# EAGLE design spion (EAGLE 6.5.0)
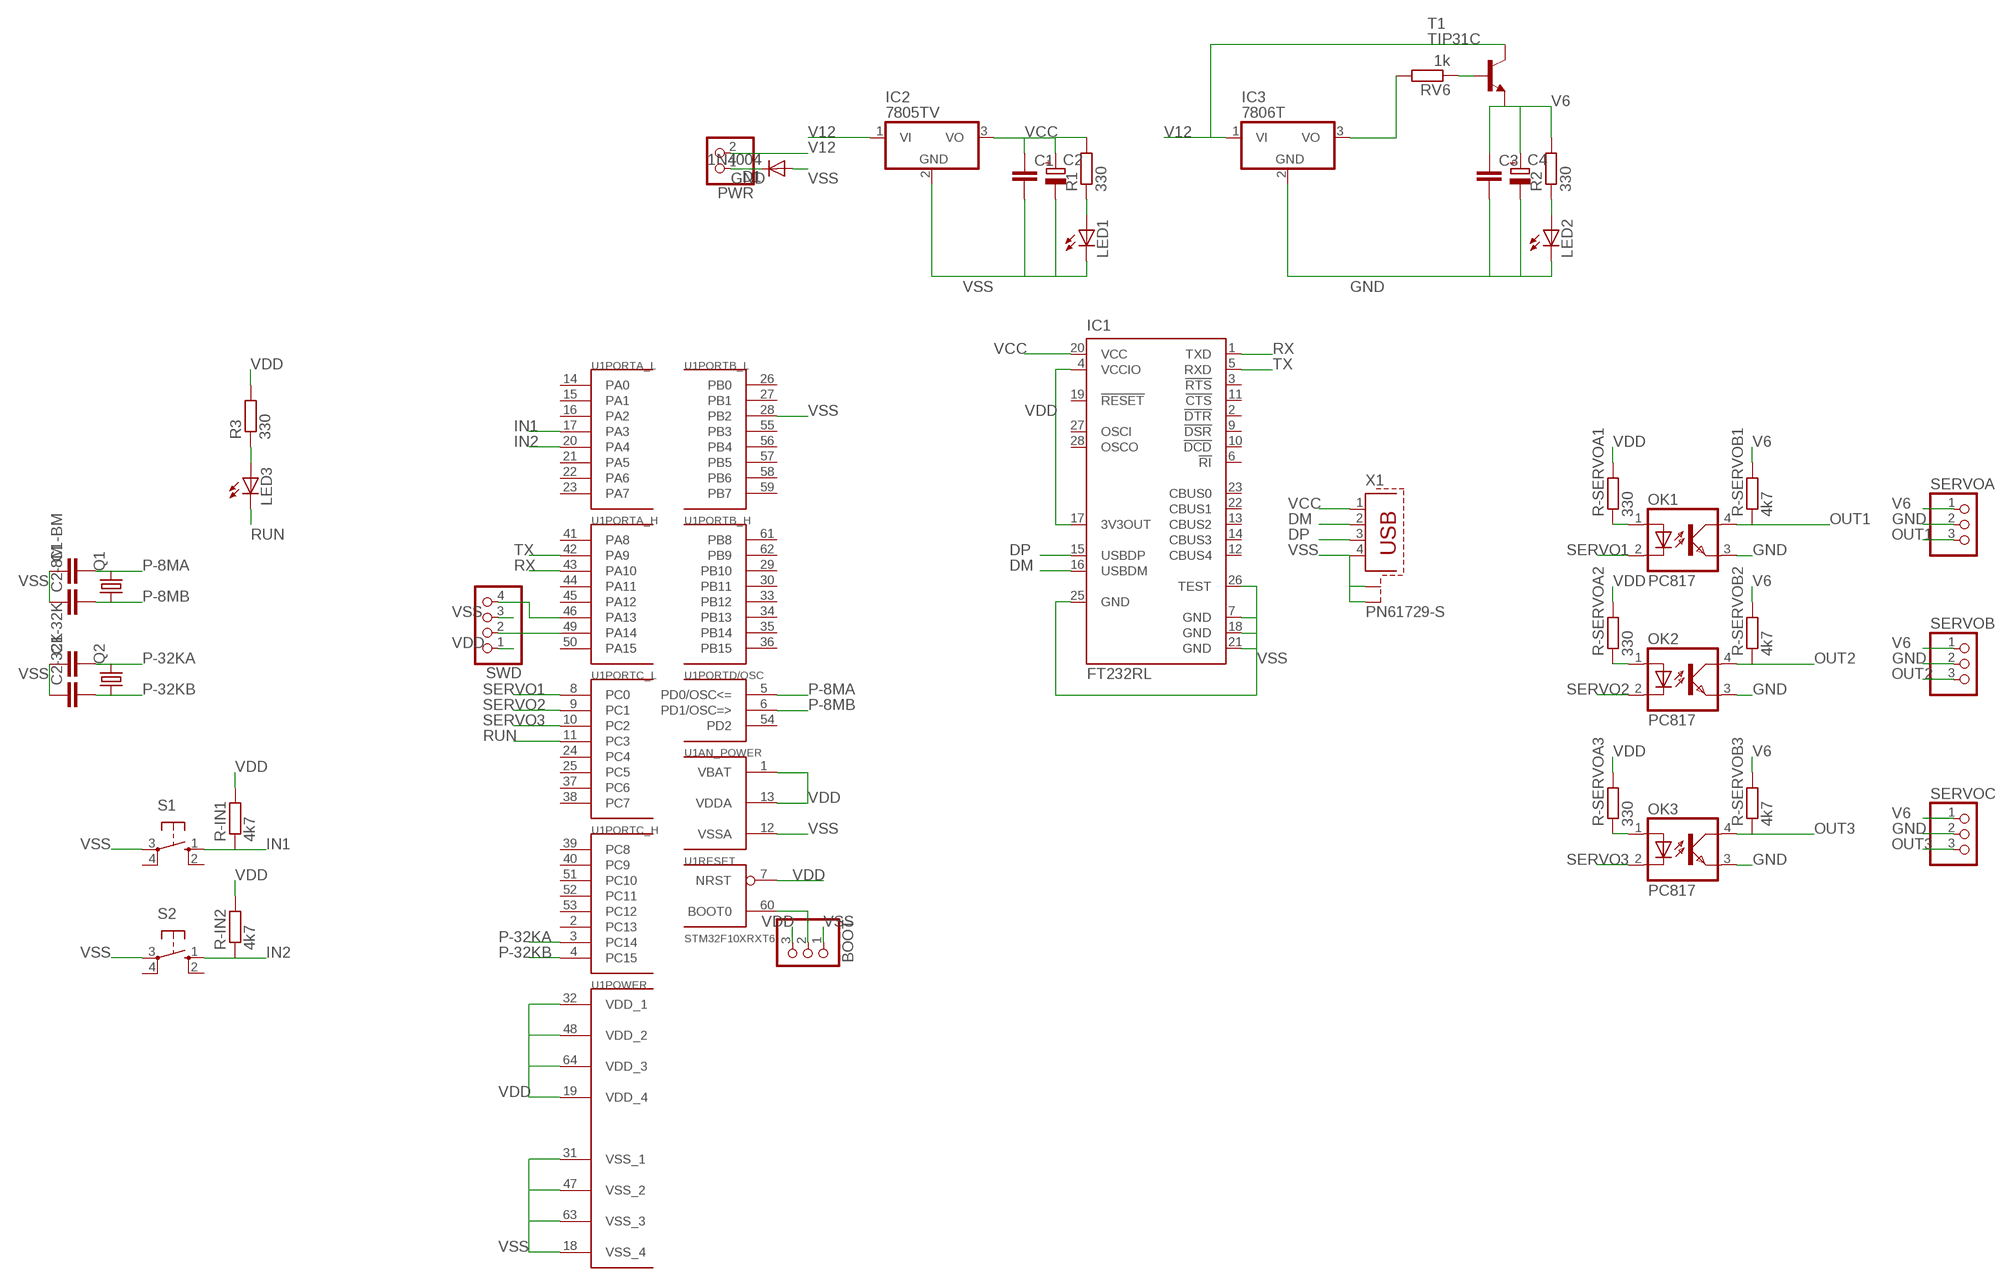
[diagram p0: schematic, sheet 1]

## Parts
BOOT  PINHD-1X3  [1X03]
C1  C-EU025-024X044  [C025-024X044]
C1-32K  C-EU025-024X044  [C025-024X044]
C1-BM  C-EU025-024X044  [C025-024X044]
C2  CPOL-EUE2-5  [E2-5]
C2-8M  C-EU025-024X044  [C025-024X044]
C2-32K  C-EU025-024X044  [C025-024X044]
C3  C-EU025-024X044  [C025-024X044]
C4  CPOL-EUE2-5  [E2-5]
D1  1N4004  [DO41-10]
IC1  FT232RL  [SSOP28]
IC2  7805TV  [TO220V]
IC3  7806T  [TO220H]
LED1  LED3MM  [LED3MM]
LED2  LED3MM  [LED3MM]
LED3  LED3MM  [LED3MM]
OK1  PC817  [DIL04]
OK2  PC817  [DIL04]
OK3  PC817  [DIL04]
PWR  PINHD-1X2  [1X02]
Q1  CRYSTALHC49S  [HC49/S]
Q2  CRYSTALTC26V  [TC26V]
R1  330  R-EU_0204/7  [0204/7]
R2  330  R-EU_0204/7  [0204/7]
R3  330  R-EU_0204/7  [0204/7]
R-IN1  4k7  R-EU_0204/7  [0204/7]
R-IN2  4k7  R-EU_0204/7  [0204/7]
R-SERVOA1  330  R-EU_0204/7  [0204/7]
R-SERVOA2  330  R-EU_0204/7  [0204/7]
R-SERVOA3  330  R-EU_0204/7  [0204/7]
R-SERVOB1  4k7  R-EU_0204/7  [0204/7]
R-SERVOB2  4k7  R-EU_0204/7  [0204/7]
R-SERVOB3  4k7  R-EU_0204/7  [0204/7]
RV6  1k  R-EU_0204/7  [0204/7]
S1  10-XX  [B3F-10XX]
S2  10-XX  [B3F-10XX]
SERVOA  PINHD-1X3  [1X03]
SERVOB  PINHD-1X3  [1X03]
SERVOC  PINHD-1X3  [1X03]
SWD  PINHD-1X4  [1X04]
T1  TIP31C  [TO220]
U1  STM32F10XRXT6  [TQFP64]
X1  PN61729-S  [PN61729-S]

## Nets
DM: IC1.16(USBDM) X1.2
DP: IC1.15(USBDP) X1.3
GND: C3.2 C4.- D1.C IC3.2(GND) LED2.K(C) OK1.3(EMIT) OK2.3(EMIT) OK3.3(EMIT) PWR.1 SERVOA.2 SERVOB.2 SERVOC.2
IN1: R-IN1.1 S1.1(S) U1.17(PORTA_L:PA3)
IN2: R-IN2.1 S2.1(S) U1.20(PORTA_L:PA4)
N$1: SWD.2 U1.49(PORTA_H:PA14)
N$2: SWD.4 U1.46(PORTA_H:PA13)
N$3: BOOT.2 U1.60(RESET:BOOT0)
N$4: OK1.1(A) R-SERVOA1.1
N$5: LED3.A R3.1
N$6: IC3.3(VO) RV6.2
N$7: OK2.1(A) R-SERVOA2.1
N$8: RV6.1 T1.1(B)
N$9: OK3.1(A) R-SERVOA3.1
N$14: LED1.A R1.1
N$18: LED2.A R2.1
OUT1: OK1.4(COL) R-SERVOB1.1 SERVOA.3
OUT2: OK2.4(COL) R-SERVOB2.1 SERVOB.3
OUT3: OK3.4(COL) R-SERVOB3.1 SERVOC.3
P-8MA: C1-BM.2 Q1.2 U1.5(PORTD/OSC:PD0/OSC<=)
P-8MB: C2-8M.2 Q1.1 U1.6(PORTD/OSC:PD1/OSC=>)
P-32KA: C1-32K.2 Q2.2 U1.3(PORTC_H:PC14)
P-32KB: C2-32K.2 Q2.1 U1.4(PORTC_H:PC15)
RUN: LED3.K(C) U1.11(PORTC_L:PC3)
RX: IC1.1(TXD) U1.43(PORTA_H:PA10)
SERVO1: OK1.2(C) U1.8(PORTC_L:PC0)
SERVO2: OK2.2(C) U1.9(PORTC_L:PC1)
SERVO3: OK3.2(C) U1.10(PORTC_L:PC2)
TX: IC1.5(RXD) U1.42(PORTA_H:PA9)
V6: C3.1 C4.+ R2.2 R-SERVOB1.2 R-SERVOB2.2 R-SERVOB3.2 SERVOA.1 SERVOB.1 SERVOC.1 T1.3(E)
V12: IC2.1(VI) IC3.1(VI) PWR.2 T1.2(C)
VCC: C1.1 C2.+ IC1.20(VCC) IC2.3(VO) R1.2 X1.1
VDD: BOOT.3 IC1.4(VCCIO) IC1.17(3V3OUT) R3.2 R-IN1.2 R-IN2.2 R-SERVOA1.2 R-SERVOA2.2 R-SERVOA3.2 SWD.1 U1.1(AN_POWER:VBAT) U1.7(RESET:NRST) U1.13(AN_POWER:VDDA) U1.19(POWER:VDD_4) U1.32(POWER:VDD_1) U1.48(POWER:VDD_2) U1.64(POWER:VDD_3)
VSS: BOOT.1 C1-32K.1 C1-BM.1 C1.2 C2-8M.1 C2-32K.1 C2.- D1.A IC1.7(GND) IC1.18(GND) IC1.21(GND) IC1.25(GND) IC1.26(TEST) IC2.2(GND) LED1.K(C) S1.3(P) S2.3(P) SWD.3 U1.12(AN_POWER:VSSA) U1.18(POWER:VSS_4) U1.28(PORTB_L:PB2) U1.31(POWER:VSS_1) U1.47(POWER:VSS_2) U1.63(POWER:VSS_3) X1.4 X1.S1 X1.S2
Unconnected: IC1.2(!DTR) IC1.3(!RTS) IC1.6(!RI) IC1.9(!DSR) IC1.10(!DCD) IC1.11(!CTS) IC1.12(CBUS4) IC1.13(CBUS2) IC1.14(CBUS3) IC1.19(!RESET) IC1.22(CBUS1) IC1.23(CBUS0) IC1.27(OSCI) IC1.28(OSCO) S1.2(S1) S1.4(P1) S2.2(S1) S2.4(P1) U1.2(PORTC_H:PC13) U1.14(PORTA_L:PA0) U1.15(PORTA_L:PA1) U1.16(PORTA_L:PA2) U1.21(PORTA_L:PA5) U1.22(PORTA_L:PA6) U1.23(PORTA_L:PA7) U1.24(PORTC_L:PC4) U1.25(PORTC_L:PC5) U1.26(PORTB_L:PB0) U1.27(PORTB_L:PB1) U1.29(PORTB_H:PB10) U1.30(PORTB_H:PB11) U1.33(PORTB_H:PB12) U1.34(PORTB_H:PB13) U1.35(PORTB_H:PB14) U1.36(PORTB_H:PB15) U1.37(PORTC_L:PC6) U1.38(PORTC_L:PC7) U1.39(PORTC_H:PC8) U1.40(PORTC_H:PC9) U1.41(PORTA_H:PA8) U1.44(PORTA_H:PA11) U1.45(PORTA_H:PA12) U1.50(PORTA_H:PA15) U1.51(PORTC_H:PC10) U1.52(PORTC_H:PC11) U1.53(PORTC_H:PC12) U1.54(PORTD/OSC:PD2) U1.55(PORTB_L:PB3) U1.56(PORTB_L:PB4) U1.57(PORTB_L:PB5) U1.58(PORTB_L:PB6) U1.59(PORTB_L:PB7) U1.61(PORTB_H:PB8) U1.62(PORTB_H:PB9)

## Library data of the parts
BOOT SERVOA SERVOB SERVOC = pinhead:PINHD-1X3: PIN HEADER
C1 C1-32K C1-BM C2-8M C2-32K C3 = resistor:C-EU: CAPACITOR, European symbol
C2 C4 = resistor:CPOL-EU: POLARIZED CAPACITOR, European symbol
D1 = diode:1N4004: DIODE general purpose rectifier, 1 A
IC1 = ftdichip:FT232R: Source: http://www.ftdichip.com/Documents/DataSheets/DS_FT232R_v104.pdf; MPN: FT232RL; OC_FARNELL: 1146032; OC_NEWARK: 91K9918
IC2 IC3 = linear:78*: Positive VOLTAGE REGULATOR Source: http://cache.national.com/ds/LM/LM78L05.pdf http://www.fairchildsemi.com/ds/LM/LM7805.pdf
LED1-LED3 = led:LED: LED OSRAM: - CHIPLED LG R971, LG N971, LY N971, LG Q971, LY Q971, LO R971, LY R971 LH N974, LH R974 LS Q976, LO Q976, LY Q976 LO Q996 - Hyper CHIPLED LW Q18S LB Q993, LB Q99A, LB R99A - SideLED LS A670, LO A670, LY A670, LG A670, LP A670 LB A673, LV A673, LT A673, LW A673 LH A674 LY A675 LS A676, LA A676, LO A676, LY A676, LW A676 LS A679, LY A679, LG A679 - Hyper Micro SIDELED® LS Y876, LA Y876, LO Y876, LY Y876 LT Y87S - SmartLED LW L88C, LW L88S LB L89C, LB L89S, LG L890 LS L89K, LO L89K, LY L89K LS L896, LA L896, LO L896, LY L896 - TOPLED LS T670, LO T670, LY T670, LG T670, LP T670 LSG T670, LSP T670, LSY T670, LOP T670, LYG T670 LG T671, LOG T671, LSG T671 LB T673, LV T673, LT T673, LW T673 LH T674 LS T676, LA T676, LO T676, LY T676, LB T676, LH T676, LSB T676, LW T676 LB T67C, LV T67C, LT T67C, LS T67K, LO T67K, LY T67K, LW E67C LS E67B, LA E67B, LO E67B, LY E67B, LB E67C, LV E67C, LT E67C LW T67C LS T679, LY T679, LG T679 LS T770, LO T770, LY T770, LG T770, LP T770 LB T773, LV T773, LT T773, LW T773 LH T774 LS E675, LA E675, LY E675, LS T675 LS T776, LA T776, LO T776, LY T776, LB T776 LHGB T686 LT T68C, LB T68C - Hyper Mini TOPLED® LB M676 - Mini TOPLED Santana® LG M470 LS M47K, LO M47K, LY M47K Source: http://www.osram.convergy.de LUXEON: - LUMILED® LXK2-PW12-R00, LXK2-PW12-S00, LXK2-PW14-U00, LXK2-PW14-V00 LXK2-PM12-R00, LXK2-PM12-S00, LXK2-PM14-U00 LXK2-PE12-Q00, LXK2-PE12-R00, LXK2-PE12-S00, LXK2-PE14-T00, LXK2-PE14-U00 LXK2-PB12-K00, LXK2-PB12-L00, LXK2-PB12-M00, LXK2-PB14-N00, LXK2-PB14-P00, LXK2-PB14-Q00 LXK2-PR12-L00, LXK2-PR12-M00, LXK2-PR14-Q00, LXK2-PR14-R00 LXK2-PD12-Q00, LXK2-PD12-R00, LXK2-PD12-S00 LXK2-PH12-R00, LXK2-PH12-S00 LXK2-PL12-P00, LXK2-PL12-Q00, LXK2-PL12-R00 Source: www.luxeon.com KINGBRIGHT: KA-3528ASYC Source: www.kingbright.com
OK1-OK3 = optocoupler:PC817: SHARP OPTO COUPLER; MPN: PC817X4J000F; OC_FARNELL: 9707727; OC_NEWARK: 97K7059
PWR = pinhead:PINHD-1X2: PIN HEADER
Q1 = crystal:CRYSTAL: CRYSTAL; OC_FARNELL: 1667008; OC_NEWARK: unknown
Q2 = crystal:CRYSTAL: CRYSTAL; OC_FARNELL: unknown; OC_NEWARK: unknown
R1-R3 R-IN1 R-IN2 R-SERVOA1-R-SERVOA3 R-SERVOB1-R-SERVOB3 RV6 = resistor:R-EU_: RESISTOR, European symbol
S1 S2 = switch-omron:10-XX: OMRON SWITCH; MPN: B3F-1000; OC_FARNELL: 176432; OC_NEWARK: 36M3542
SWD = pinhead:PINHD-1X4: PIN HEADER
T1 = transistor-neu-to92:TIP31C: NPN TRANSISTOR
U1 = stm32:STM32F10XRXT6: STM32F101/103 64pin LQFP
X1 = con-berg:PN61729-S: BERG USB connector; OC_FARNELL: unknown; OC_NEWARK: unknown

## Board
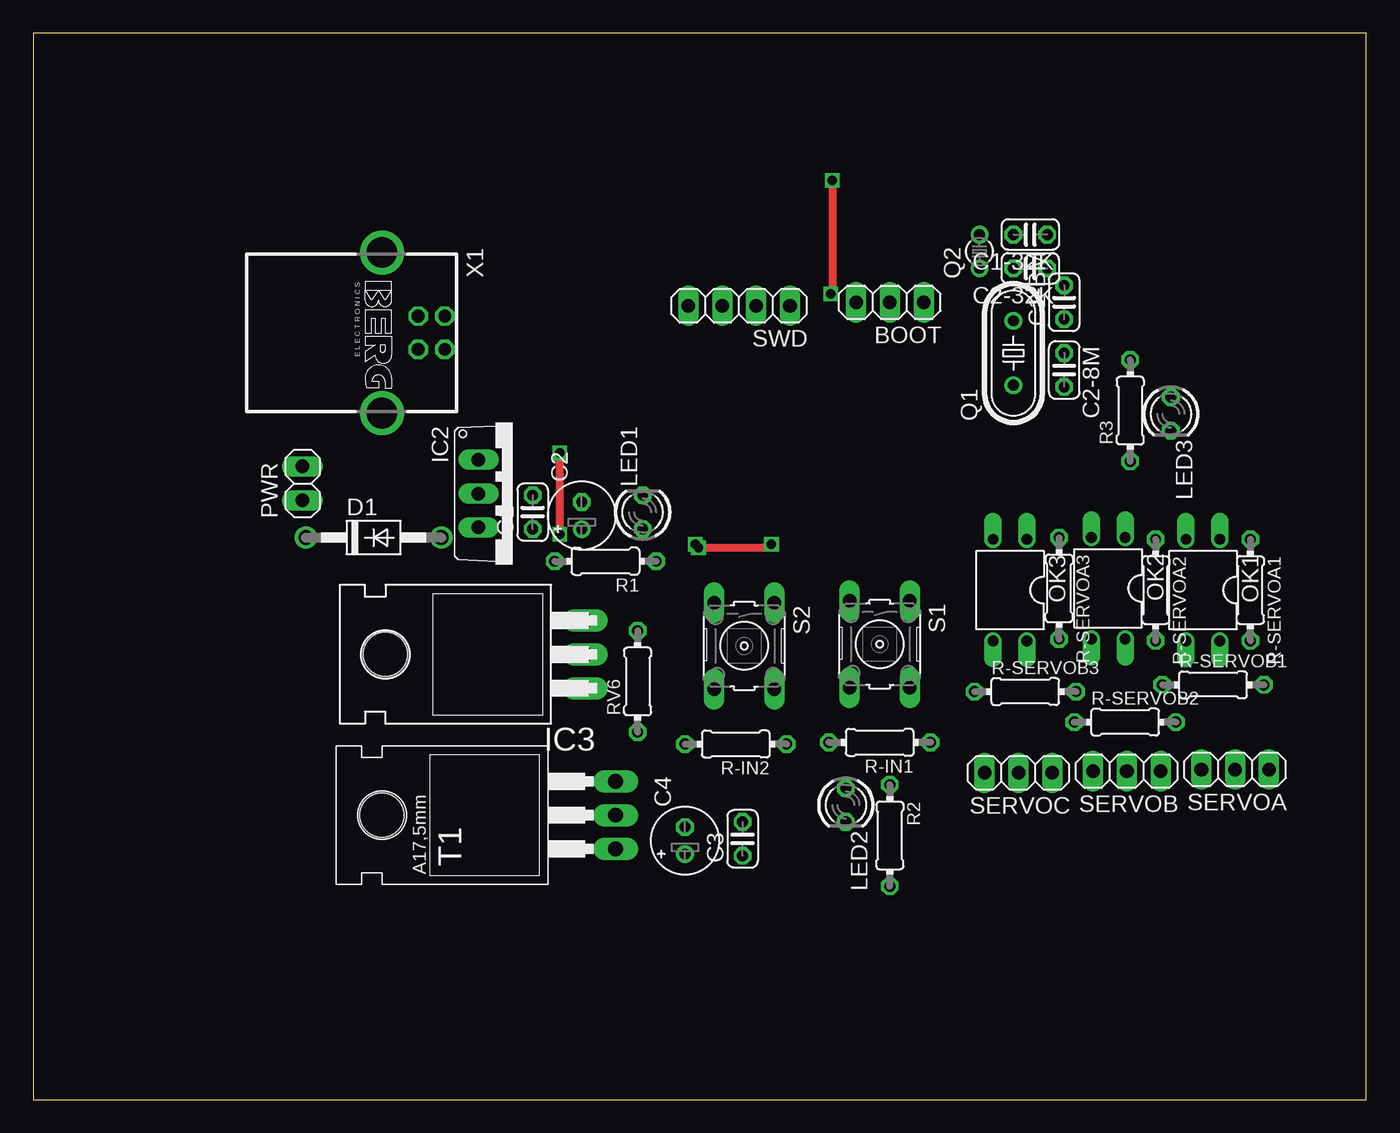
[diagram p1: board, top side]
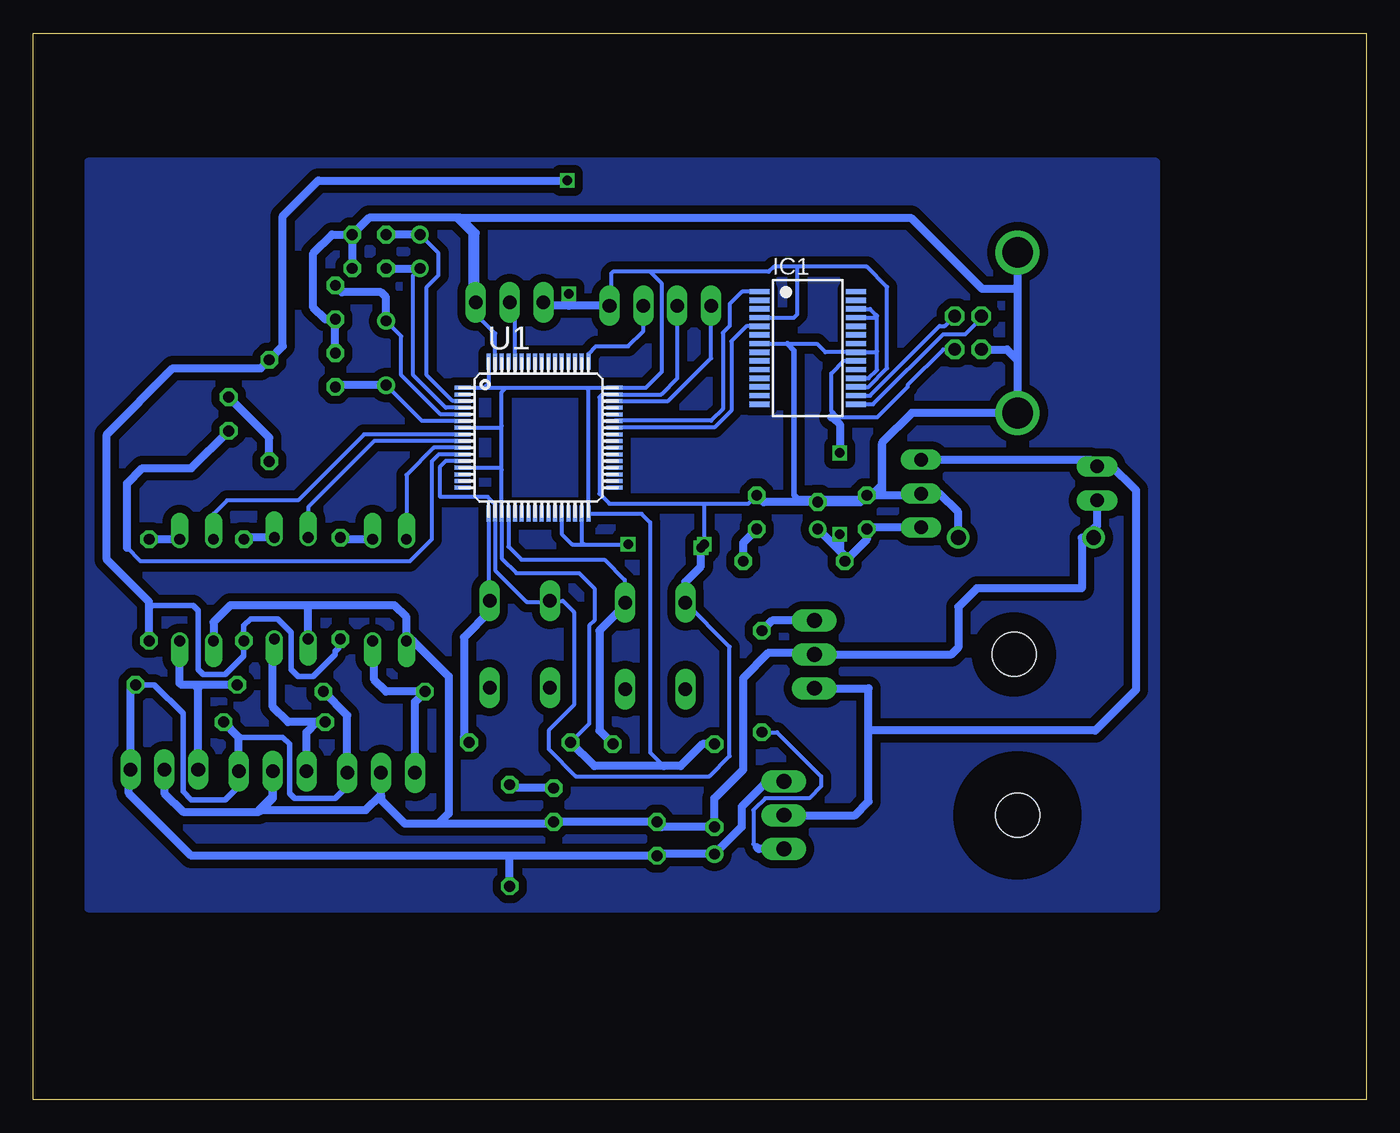
[diagram p2: board, bottom side, seen from below]

Size 100 x 80 mm. Coordinates in mm from the lower left corner, seen from the top.
Outline: 0,0 100,0 100,80 0,80 0,0
Copper layers (1*16): Top 0.035mm / dielectric 1.5mm / Bottom 0.035mm
Design rules "default": minimum track width 10mil, minimum drill 24mil, track to track 8mil, track to pad 8mil, pad to pad 8mil, via to via 8mil, smd to smd 8mil, copper to edge 40mil, drill to drill 8mil, minimum pad ring 10mil, minimum via ring 8mil, stop-mask expansion 4mil, vias tented up to drill 0mil, thermal gap 10mil

### Footprints (pad centres in the part's own frame; a part is rotated, then mirrored left to right if it is on the bottom)
1X03 = drill 1.016 long: 1 -2.54,0; 2 0,0; 3 2.54,0
C025-024X044 = drill 0.813 octagon: 1 -1.27,0; 2 1.27,0
E2-5 = drill 0.813 pad 1.27: + -1.016,0 | drill 0.813 pad 1.27 octagon: - 1.016,0
DO41-10 = drill 1.118: A 5.08,0; C -5.08,0
SSOP28 = smd 0.4 x 1.5: 1 -4.225,-3.625; 2 -3.575,-3.625; 3 -2.925,-3.625; 4 -2.275,-3.625; 5 -1.625,-3.625; 6 -0.975,-3.625; 7 -0.325,-3.625; 8 0.325,-3.625; 9 0.975,-3.625; 10 1.625,-3.625; 11 2.275,-3.625; 12 2.925,-3.625; 13 3.575,-3.625; 14 4.225,-3.625; 15 4.225,3.625; 16 3.575,3.625; 17 2.925,3.625; 18 2.275,3.625; 19 1.625,3.625; 20 0.975,3.625; 21 0.325,3.625; 22 -0.325,3.625; 23 -0.975,3.625; 24 -1.625,3.625; 25 -2.275,3.625; 26 -2.925,3.625; 27 -3.575,3.625; 28 -4.225,3.625
TO220V = drill 1.016 long: 1 -2.54,-2.54; 2 0,-2.54; 3 2.54,-2.54
TO220H = drill 1.118 long: 1 -2.54,-10.16; 2 0,-10.16; 3 2.54,-10.16 | hole 3.302: 0,4.826
LED3MM = drill 0.813 octagon: A -1.27,0; K 1.27,0
DIL04 = drill 0.813 offset: 1 -1.27,-3.81; 2 1.27,-3.81; 3 1.27,3.81; 4 -1.27,3.81
1X02 = drill 1.016 long: 1 -1.27,0; 2 1.27,0
HC49/S = drill 0.813: 1 -2.413,0; 2 2.413,0
TC26V = drill 0.813: 1 -1.27,0; 2 1.27,0
0204/7 = drill 0.813 octagon: 1 -3.81,0; 2 3.81,0
B3F-10XX = drill 1.016 long: 1 -3.251,2.261; 2 3.251,2.261; 3 -3.251,-2.261; 4 3.251,-2.261
1X04 = drill 1.016 long: 1 -3.81,0; 2 -1.27,0; 3 1.27,0; 4 3.81,0
TO220 = drill 1.118 long: 1 -2.54,-6.35; 2 0,-6.35; 3 2.54,-6.35 | hole 3.302: 0,11.176
TQFP64 = smd 1.2 x 0.3: 1 -5.7,3.75; 2 -5.7,3.25; 3 -5.7,2.75; 4 -5.7,2.25; 5 -5.7,1.75; 6 -5.7,1.25; 7 -5.7,0.75; 8 -5.7,0.25; 9 -5.7,-0.25; 10 -5.7,-0.75; 11 -5.7,-1.25; 12 -5.7,-1.75; 13 -5.7,-2.25; 14 -5.7,-2.75; 15 -5.7,-3.25; 16 -5.7,-3.75; 33 5.7,-3.75; 34 5.7,-3.25; 35 5.7,-2.75; 36 5.7,-2.25; 37 5.7,-1.75; 38 5.7,-1.25; 39 5.7,-0.75; 40 5.7,-0.25; 41 5.7,0.25; 42 5.7,0.75; 43 5.7,1.25; 44 5.7,1.75; 45 5.7,2.25; 46 5.7,2.75; 47 5.7,3.25; 48 5.7,3.75 | smd 0.3 x 1.2: 17 -3.75,-5.7; 18 -3.25,-5.7; 19 -2.75,-5.7; 20 -2.25,-5.7; 21 -1.75,-5.7; 22 -1.25,-5.7; 23 -0.75,-5.7; 24 -0.25,-5.7; 25 0.25,-5.7; 26 0.75,-5.7; 27 1.25,-5.7; 28 1.75,-5.7; 29 2.25,-5.7; 30 2.75,-5.7; 31 3.25,-5.7; 32 3.75,-5.7; 49 3.75,5.7; 50 3.25,5.7; 51 2.75,5.7; 52 2.25,5.7; 53 1.75,5.7; 54 1.25,5.7; 55 0.75,5.7; 56 0.25,5.7; 57 -0.25,5.7; 58 -0.75,5.7; 59 -1.25,5.7; 60 -1.75,5.7; 61 -2.25,5.7; 62 -2.75,5.7; 63 -3.25,5.7; 64 -3.75,5.7
PN61729-S = drill 0.95 octagon: 1 1.25,4.71; 2 -1.25,4.71; 3 -1.25,2.71; 4 1.25,2.71 | drill 2.3 pad 2.9: S1 -6.02,0; S2 6.02,0

### Placement (x,y rotation side)
BOOT  64.26,59.82 180 top
C1  37.47,44.07 90 top
C1-32K  74.8,64.9 180 top
C1-BM  77.34,59.82 90 top
C2  41.15,43.81 90 top
C2-8M  77.34,54.74 270 top
C2-32K  74.8,62.36 180 top
C3  53.21,19.56 90 top
C4  48.9,19.43 90 top
D1  25.53,42.16 0 top
IC1  41.91,56.39 270 bottom
IC2  35.94,45.47 270 top
IC3  31.24,33.4 90 top
LED1  45.72,44.07 90 top
LED2  60.96,22.1 270 top
LED3  85.34,51.44 270 top
OK1  87.76,38.23 180 top
OK2  80.64,38.35 180 top
OK3  73.28,38.23 180 top
PWR  20.19,46.23 90 top
Q1  73.53,56.01 90 top
Q2  70.99,63.63 90 top
R1  42.93,40.39 180 top
R2  64.26,19.81 270 top
R3  82.3,51.69 90 top
R-IN1  63.5,26.8 180 top
R-IN2  52.7,26.67 180 top
R-SERVOA1  91.31,38.23 270 top
R-SERVOA2  84.2,38.23 270 top
R-SERVOA3  76.96,38.35 270 top
R-SERVOB1  88.52,31.11 0 top
R-SERVOB2  81.92,28.32 0 top
R-SERVOB3  74.42,30.61 0 top
RV6  45.34,31.37 90 top
S1  63.5,34.16 270 top
S2  53.34,34.04 270 top
SERVOA  90.17,24.77 180 top
SERVOB  82.04,24.64 180 top
SERVOC  73.91,24.51 180 top
SWD  52.96,59.56 180 top
T1  37.34,21.34 90 top
U1  62.1,49.66 0 bottom
X1  26.16,57.53 270 top

### Tracks (layer width: path | path; a pad name or v marks a point on that pad's centre or on a via)
DM
  Bottom 0.305: IC1.16 37.23,52.81 32,58.04 31.61,58.04 X1.2
DP
  Bottom 0.305: X1.3 28.87,58.63 30.1,57.4 31.75,57.4 36.99,52.16 IC1.15
GND
  Bottom 0.61: 79.38,37.08 72.9,37.08 72.01,36.2 OK3.3 71.5,34.42 68.83,31.75 68.83,21.46 69.6,20.7 | 79.38,37.08 85.22,37.08 86.49,35.81 OK1.3 | OK2.3 79.38,37.08 | SERVOA.2 90.17,22.99 88.77,21.59 83.06,21.59 82.04,22.61 SERVOB.2 82.04,22.73 83.06,21.72 75.06,21.72 73.91,22.86 | 73.91,22.86 SERVOC.2 | 41.91,33.53 44.83,33.53 46.74,31.62 46.74,24.77 48.9,22.61 C4.- 52.83,20.45 C3.2 LED2.K 61.09,20.7 69.6,20.7 | 41.91,33.53 41.53,33.53 IC3.2 | D1.C 21.08,42.16 | 21.08,42.16 21.34,42.16 21.34,38.35 29.21,38.35 30.61,36.96 30.61,33.91 31.11,33.4 41.78,33.4 41.91,33.53 | PWR.1 20.19,43.05 21.08,42.16 | 73.91,22.86 73.91,22.48 72.14,20.7 69.6,20.7
IN1
  Bottom 0.305: U1.17 65.85,37.51 S1.1
  Bottom 0.61: S1.1 65.76,36.6 67.69,34.67 67.69,27.18 R-IN1.1
IN2
  Bottom 0.305: U1.20 64.35,41.49 63.37,40.51 57.15,40.51 55.63,38.99 55.63,37.31 S2.1
  Bottom 0.61: S2.1 55.6,37.11 57.53,35.18 57.53,27.69 R-IN2.1
N$1
  Bottom 0.305: U1.49 58.35,55.95 57.78,56.52 55.37,56.52 54.23,57.66 SWD.2
N$2
  Bottom 0.305: U1.46 52.37,52.41 49.15,55.63 SWD.4
N$3
  Bottom 0.305: U1.60 63.85,59.41 BOOT.2
N$4
  Bottom 0.61: OK1.1 R-SERVOA1.1
N$5
  Bottom 0.61: R3.1 82.3,49.66 LED3.A
N$6
  Bottom 0.61: IC3.3 44.58,35.94 RV6.2
N$7
  Bottom 0.61: OK2.1 84.07,42.16 R-SERVOA2.1
N$8
  Bottom 0.305: RV6.1 44.2,27.56 40.89,24.26 40.89,23.5 41.78,22.61 45.09,22.61 45.97,21.72 45.97,19.18 45.72,18.92
  Bottom 0.61: T1.1 45.59,18.8 45.72,18.92
N$9
  Bottom 0.61: OK3.1 76.83,42.04 R-SERVOA3.1
N$10
  pour Bottom (isolate 0.61): 15.75,70.36 95.89,70.36 95.89,14.35 15.75,14.35
N$14
  Bottom 0.61: R1.1 46.74,41.78 LED1.A
N$18
  Bottom 0.61: LED2.A 64.01,23.37 R2.1
OUT1
  Bottom 0.61: R-SERVOB1.1 87.88,31.11 | 87.88,31.11 88.9,31.11 89.03,31.24 OK1.4 | SERVOA.3 87.63,30.86 87.88,31.11
OUT2
  Bottom 0.61: R-SERVOB2.1 78.74,28.32 | 78.74,28.32 80.9,28.32 82.04,29.46 82.04,34.42 OK2.4 | SERVOB.3 79.5,27.56 78.74,28.32
OUT3
  Bottom 0.61: OK3.4 74.42,34.29 74.42,31.5 73.53,30.61 R-SERVOB3.1 71.37,29.84 SERVOC.3
P-8MA
  Bottom 0.305: U1.5 69.44,51.41 72.39,54.36 72.39,57.28 Q1.2
  Bottom 0.61: Q1.2 73.53,60.2 73.91,60.58 76.83,60.58 C1-BM.2
P-8MB
  Bottom 0.305: U1.6 70.85,50.91 Q1.1
  Bottom 0.61: Q1.1 77.22,53.59 C2-8M.2
P-32KA
  Bottom 0.305: U1.3 68.54,52.41 70.48,54.36 70.48,60.96 69.6,61.85 69.6,63.5 Q2.2
  Bottom 0.61: Q2.2 C1-32K.2
P-32KB
  Bottom 0.305: U1.4 69.05,51.91 71.5,54.36 71.5,61.85 Q2.1
  Bottom 0.61: C2-32K.2 Q2.1
RUN
  Bottom 0.305: U1.11 69.58,48.41 70.1,47.88 70.1,42.04 71.75,40.39 91.95,40.39 92.96,41.4
  Bottom 0.61: 92.96,41.4 92.96,46.23 91.82,47.37 88.14,47.37 LED3.K
RX
  Bottom 0.305: IC1.1 46.83,60.61 47.75,59.69 47.75,58.04 48.26,57.53 48.26,51.82 49.15,50.93 56.38,50.93 U1.43
SERVO1
  Bottom 0.305: U1.8 75.19,49.91 80.14,44.96 85.47,44.96 86.49,43.94 OK1.2
SERVO2
  Bottom 0.305: U1.9 74.42,49.41 79.38,44.45 OK2.2
SERVO3
  Bottom 0.305: U1.10 69.97,48.91 72.01,46.86 OK3.2
TX
  Bottom 0.305: IC1.5 46.51,58.01 47.62,56.9 47.62,51.69 48.9,50.42 U1.42
V6
  Bottom 0.406: 84.58,27.18 81.28,27.18 80.77,26.67 80.77,22.99 80.39,22.61 77.34,22.61 76.45,23.5 SERVOC.1 | R-SERVOB1.2 90.93,31.11 88.77,28.96 88.77,23.11 88.14,22.48 85.6,22.48 84.71,23.37 84.71,24.51 SERVOB.1
  Bottom 0.61: SERVOB.1 84.58,27.18 R-SERVOB2.2 | R-SERVOB1.2 92.71,30.73 SERVOA.1 92.84,24.64 92.84,22.99 88.14,18.29 64.14,18.29 | SERVOC.1 76.45,28.83 R-SERVOB3.2 | T1.3 44.96,23.88 46.86,21.97 46.86,20.45 C4.+ 53.09,18.41 C3.1 64.14,18.29 | R2.2 64.26,18.16 64.14,18.29
V12
  Bottom 0.61: IC2.1 20.7,48.01 PWR.2 20.07,47.62 19.18,47.62 17.27,45.72 17.27,30.73 20.32,27.69 37.21,27.69 37.34,27.56 | IC3.1 37.34,30.86 37.34,27.56 | T1.2 38.35,21.34 37.34,22.35 37.34,27.56
VCC  (via drill 0.7)
  Top 0.61: v39.5,48.51 v39.5,42.42
  Bottom 0.305: X1.1 31.73,56.28 34.42,53.59 34.42,53.47 36.7,51.18 39.62,51.18 40.13,51.69 | 40.13,51.69 40.13,54.48 39.2,55.41 IC1.20 | 40.13,51.69 40.13,51.18
  Bottom 0.61: IC2.3 37.34,42.93 C1.1 37.47,42.04 R1.2 39.12,40.77 39.5,41.15 | 39.5,41.15 C2.+ | 40.13,51.18 40.01,51.18 39.5,50.67 v39.5,48.51 | v39.5,42.42 39.5,41.15
VDD  (via drill 0.7)
  Top 0.61: v59.94,68.96 59.94,60.58 v59.82,60.45
  Bottom 0: 76.96,34.04 76.96,33.78 78.11,32.64 | 81.66,36.07 83.82,36.07 84.2,35.69 84.2,33.27 | 88.01,37.08 91.19,37.08 91.44,37.34 91.44,37.47 94.49,40.51
  Bottom 0.305: 53.72,62.1 52.83,61.21 52.83,54.61 54.03,53.41 U1.48 58.55,53.41 | 53.72,62.1 56.52,62.1 56.64,61.98 56.64,59.69 SWD.1 | IC1.17 37.34,53.46 35.94,54.86 35.94,60.96 37.47,62.48 42.67,62.48 | 42.67,62.48 44.45,62.48 44.83,62.1 53.72,62.1 | IC1.4 42.94,58.66 42.67,58.93 42.67,62.48 | U1.1 66.17,53.41 | 66.17,53.41 64.52,53.41 | 64.52,53.41 58.55,53.41 | U1.64 65.85,53.72 66.17,53.41 | 58.55,53.41 58.35,53.21 U1.32 57.16,43.96 57.15,43.94 54.36,43.94 53.72,43.31 53.72,26.04 52.7,25.02 | 64.85,47.24 U1.19 64.85,40.6 63.75,39.5 59.05,39.5 57.91,38.35 57.91,35.94 58.29,35.56 58.29,28.19 R-IN1.2 | 64.85,47.24 64.85,50.55 | 64.85,50.55 64.85,53.07 64.52,53.41 | U1.7 64.99,50.41 64.85,50.55 | U1.13 65.02,47.41 64.85,47.24
  Bottom 0.406: R-SERVOA3.2 76.96,34.04 77.34,33.66 77.34,33.4 78.11,32.64 78.99,31.75 80.14,31.75 80.64,32.26 80.64,35.05 81.66,36.07 83.69,36.07 84.2,35.56 R-SERVOA2.2 84.2,33.27 85.6,31.88 87.25,31.88 87.63,32.26 87.63,36.7 88.01,37.08 91.06,37.08 91.31,36.83 R-SERVOA1.2
  Bottom 0.61: SWD.1 59.82,59.56 | 59.82,59.56 61.47,59.56 BOOT.3 | R-IN2.2 49.78,26.67 51.44,25.02 52.7,25.02 57.91,25.02 R-IN1.2 | R-SERVOA1.2 91.31,37.34 94.49,40.51 94.49,49.91 89.53,54.86 82.93,54.86 R3.2 81.28,56.52 81.28,66.29 78.61,68.96 v59.94,68.96 | v59.82,60.45 59.82,59.56
VSS  (via drill 0.7)
  Top 0.61: v49.91,41.4 55.12,41.4 v55.37,41.66
  Bottom 0.305: IC1.18 37.33,54.11 36.7,54.74 36.7,56.13 | 36.7,56.13 36.7,58.8 36.77,58.86 | 36.77,58.86 37.22,59.31 IC1.26 | IC1.25 36.97,58.66 36.77,58.86 | 36.7,56.13 36.77,56.06 IC1.21 40.57,56.06 41.22,56.71 43.43,56.71 IC1.7 | S2.3 47.75,33.96 47.75,25.78 49.28,24.26 59.31,24.26 61.34,26.29 61.34,27.69 59.44,29.59 59.44,36.58 60.27,37.41 S1.3 61.32,37.34 62.99,37.34 65.35,39.7 U1.18 65.35,44.65 65.91,45.21 69.47,45.21 69.47,47.5 69.06,47.91 U1.12 | 49.53,44.7 56.77,44.7 57.53,45.47 57.53,52.7 57.33,52.91 U1.47 52.88,52.91 51.69,54.1 SWD.3 | 49.53,44.7 46.35,44.7 LED1.K | U1.28 60.35,42.45 59.56,41.66 58.67,41.66 | 58.67,41.66 v55.37,41.66 | v49.66,41.66 49.66,44.58 49.53,44.7 | U1.31 58.85,41.84 58.67,41.66 | 66.93,59.05 65.35,57.48 U1.63 | 66.93,59.05 66.93,59.69 BOOT.1 | 66.93,59.05 67.06,59.18
  Bottom 0.406: 34.09,51.51 36.45,49.15 36.45,46.1 37.47,45.09 42.67,45.09 42.93,45.34 42.93,56.2 43.43,56.71
  Bottom 0.61: C1-32K.1 C2-32K.1 | C2-8M.1 C1-BM.1 78.11,58.55 78.99,59.44 78.99,63.5 77.6,64.9 C1-32K.1 | BOOT.1 66.8,65.02 67.94,66.17 | 67.94,66.17 68.2,66.17 | 68.2,66.17 74.8,66.17 C1-32K.1 | LED1.K 45.21,44.83 C2.- 37.97,44.83 C1.2 36.45,45.34 | 36.45,45.34 33.53,45.34 IC2.2 32,45.47 30.61,44.07 D1.A | X1.S1 26.16,61.09 | 26.16,61.09 26.16,55.5 | 26.16,55.5 X1.S2 34.09,51.51 36.32,49.28 36.32,45.47 36.45,45.34 | X1.4 26.94,56.28 26.16,55.5 | S2.3 51.08,38.84 49.91,40.01 v49.91,41.4 v49.66,41.66 | 67.06,59.18 67.06,65.02 68.2,66.17 | 67.94,66.17 34.16,66.17 28.83,60.83 26.42,60.83 26.16,61.09